# EAGLE design UNOSMD_V11 (EAGLE 9.6.2)
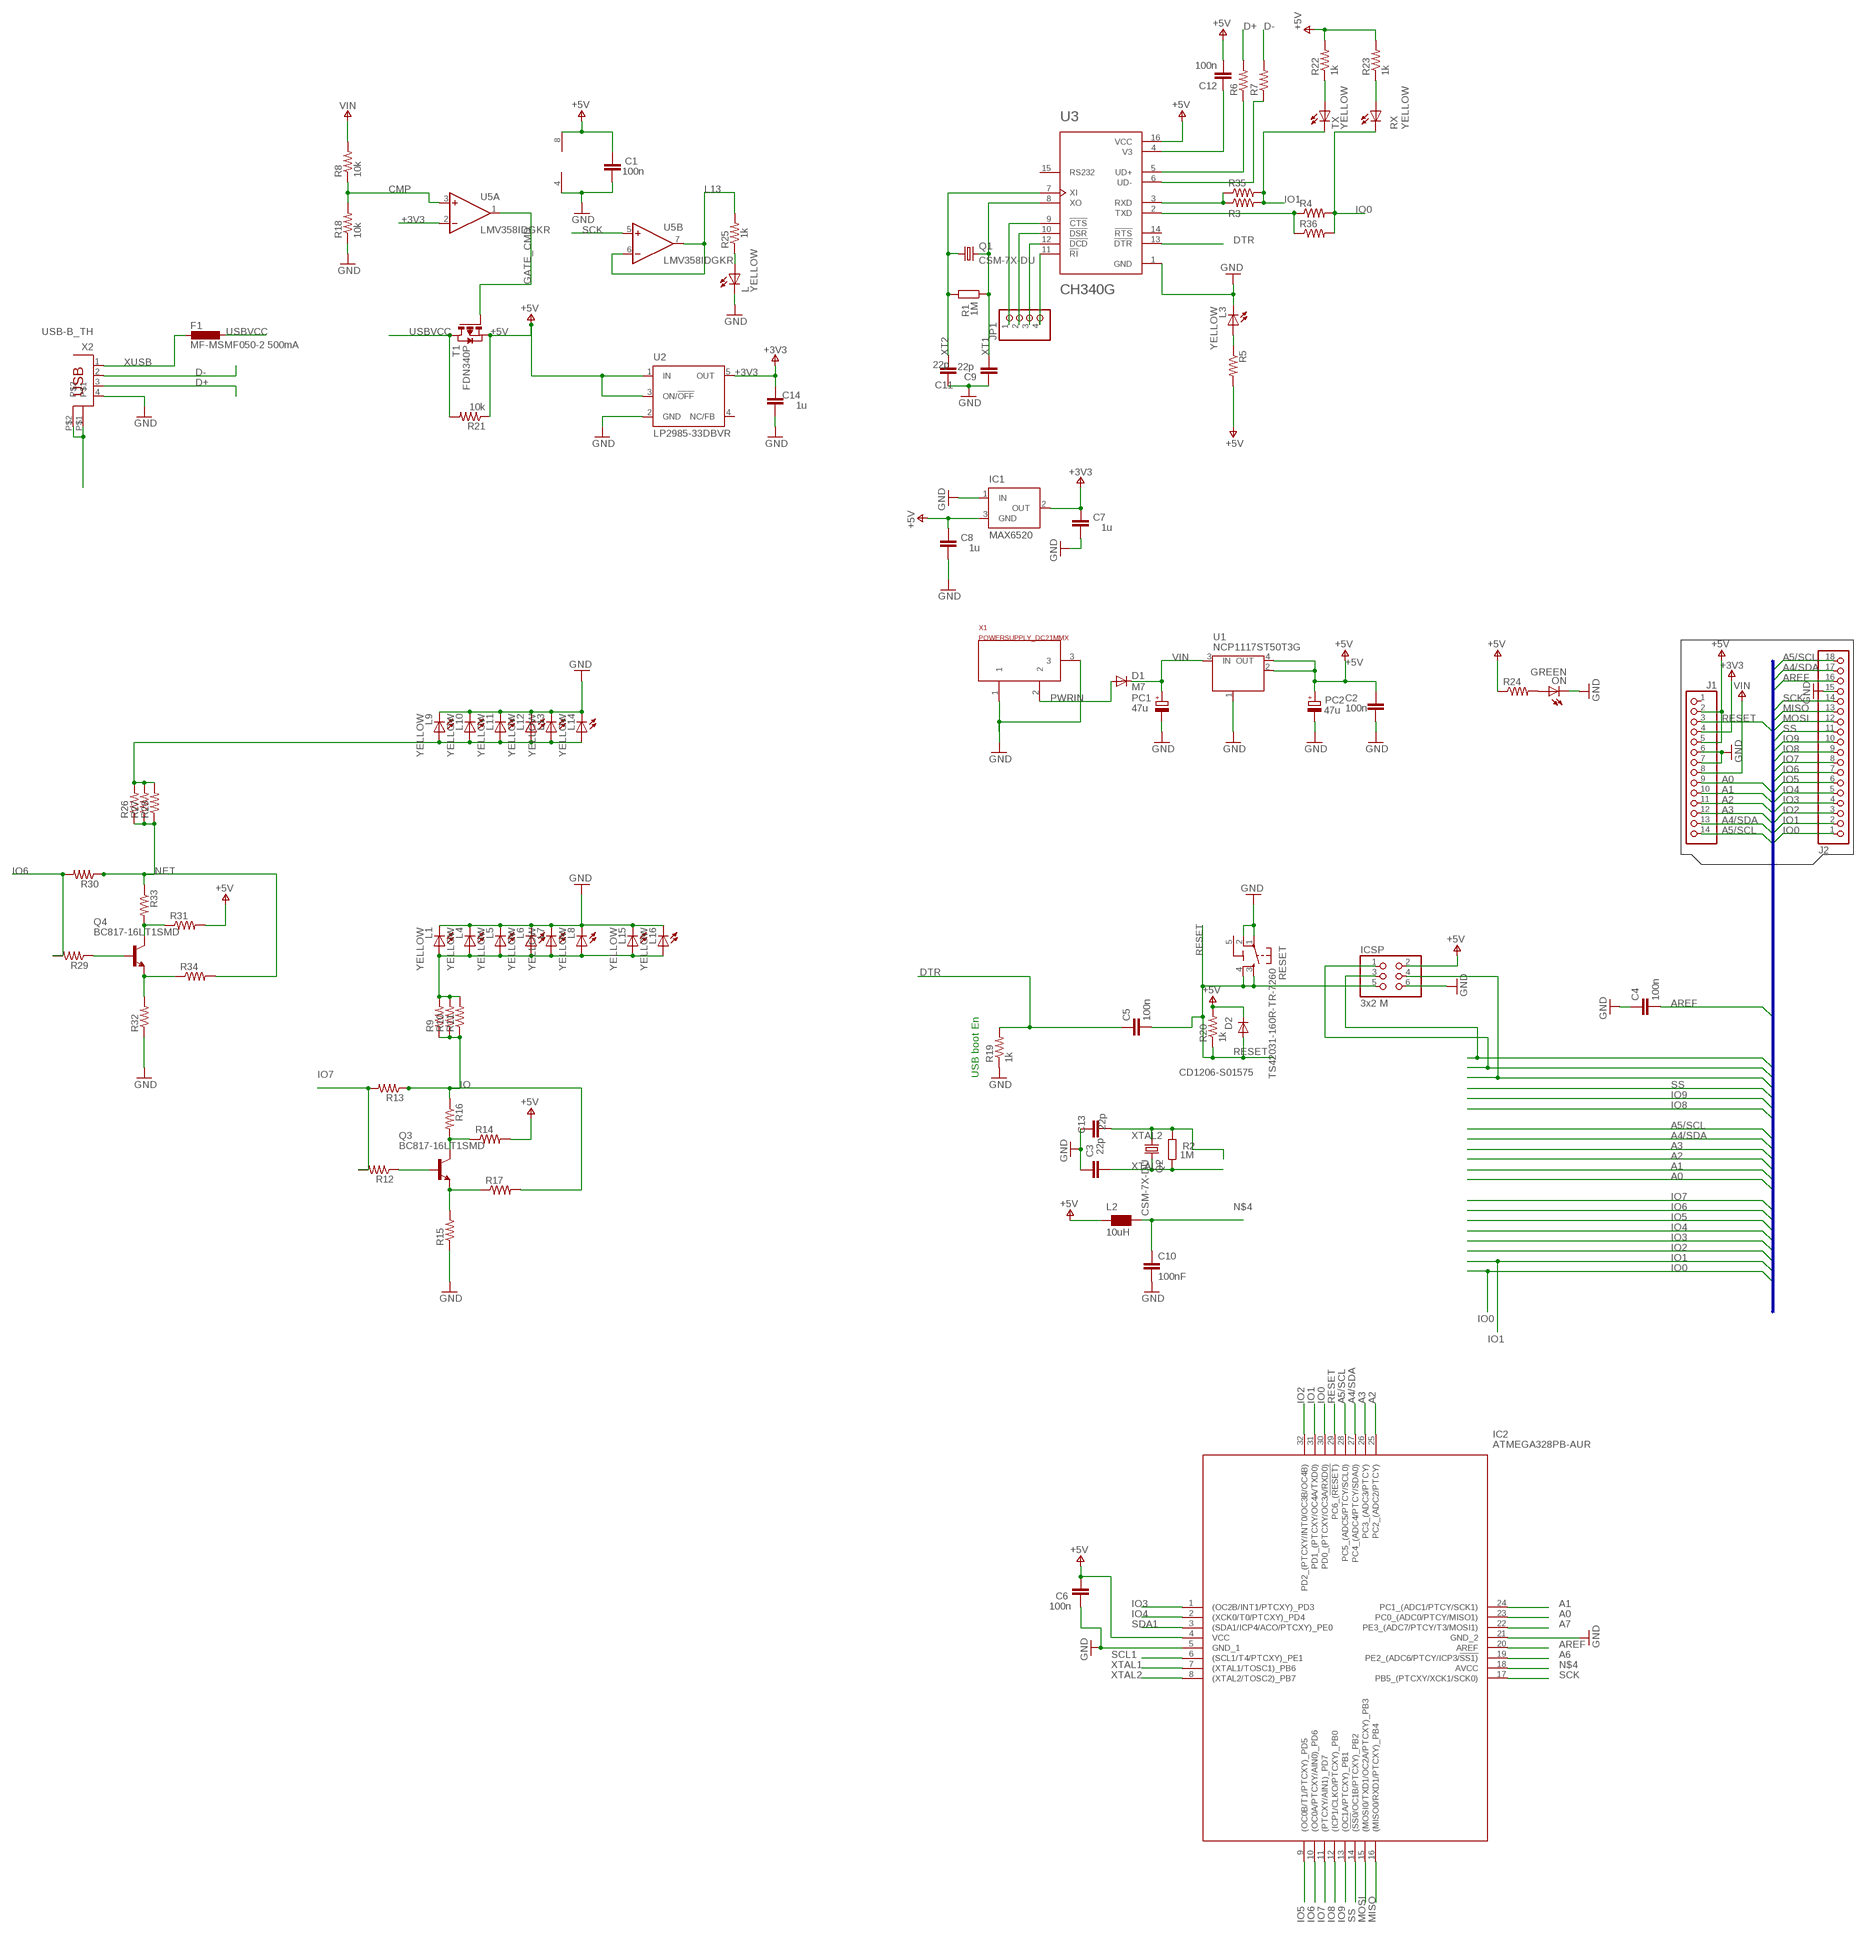
[diagram p0: schematic, sheet 1]

## Parts
C1  100n  C-EU0603-RND  [C0603-ROUND]
C2  100n  C-EU0603-RND  [C0603-ROUND]
C3  22p  C-EU0603-RND  [C0603-ROUND]
C4  100n  C-EU0603-RND  [C0603-ROUND]
C5  100n  C-EU0603-RND  [C0603-ROUND]
C6  100n  C-EU0603-RND  [C0603-ROUND]
C7  1u  C-EU0603-RND  [C0603-ROUND]
C8  1u  C-EU0603-RND  [C0603-ROUND]
C9  22p  C-EU0603-RND  [C0603-ROUND]
C10  100nF  0015_100NF_0603  [C0603-ROUND]
C11  22p  C-EU0603-RND  [C0603-ROUND]
C12  100n  C-EU0603-RND  [C0603-ROUND]
C13  22p  C-EU0603-RND  [C0603-ROUND]
C14  1u  C-EU0603-RND  [C0603-ROUND]
D1  M7  DIODE-SMB  [SMB]
D2  CD1206-S01575  DIODE-MINIMELF  [MINIMELF]
F1  MF-MSMF050-2 500mA  L-EUL1812  [L1812]
IC1  MAX6520  [SOT23]
IC2  ATMEGA328PB-AUR  [QFP80P900X900X120-32N]
ICSP  3x2 M  PINHD-2X3  [2X03]
J1  -  PINHD-1X14-CUSTOM  [1X14-CUSTOM]
J2  -  PINHD-1X18  [1X18-CUSTOM]
JP1  PINHD-1X4  [1X04]
L  YELLOW  LEDCHIP-LED0805  [CHIP-LED0805]
L1  YELLOW  LEDCHIP-LED0805  [CHIP-LED0805]
L2  10uH  0715_CV201210-100K  [0805]
L3  YELLOW  LEDCHIP-LED0805  [CHIP-LED0805]
L4  YELLOW  LEDCHIP-LED0805  [CHIP-LED0805]
L5  YELLOW  LEDCHIP-LED0805  [CHIP-LED0805]
L6  YELLOW  LEDCHIP-LED0805  [CHIP-LED0805]
L7  YELLOW  LEDCHIP-LED0805  [CHIP-LED0805]
L8  YELLOW  LEDCHIP-LED0805  [CHIP-LED0805]
L9  YELLOW  LEDCHIP-LED0805  [CHIP-LED0805]
L10  YELLOW  LEDCHIP-LED0805  [CHIP-LED0805]
L11  YELLOW  LEDCHIP-LED0805  [CHIP-LED0805]
L12  YELLOW  LEDCHIP-LED0805  [CHIP-LED0805]
L13  YELLOW  LEDCHIP-LED0805  [CHIP-LED0805]
L14  YELLOW  LEDCHIP-LED0805  [CHIP-LED0805]
L15  YELLOW  LEDCHIP-LED0805  [CHIP-LED0805]
L16  YELLOW  LEDCHIP-LED0805  [CHIP-LED0805]
ON  GREEN  LEDCHIP-LED0805  [CHIP-LED0805]
PC1  47u  CPOL-EUD  [PANASONIC_D]
PC2  47u  CPOL-EUD  [PANASONIC_D]
Q1  CSM-7X-DU  [CSM-7X-DU]
Q2  CSM-7X-DU  [CSM-7X-DU]
Q3  BC817-16LT1SMD  [SOT23-BEC]
Q4  BC817-16LT1SMD  [SOT23-BEC]
R1  1M  R-EU_R0603  [R0603-ROUND]
R2  1M  R-EU_R0603  [R0603-ROUND]
R3  R-US_R0603  [R0603]
R4  R-US_R0603  [R0603]
R5  R-US_R0603  [R0603]
R6  R-US_R0603  [R0603]
R7  R-US_R0603  [R0603]
R8  10k  R-US_R0603  [R0603]
R9  R-US_R0603  [R0603]
R10  R-US_R0603  [R0603]
R11  R-US_R0603  [R0603]
R12  R-US_R0603  [R0603]
R13  R-US_R0603  [R0603]
R14  R-US_R0603  [R0603]
R15  R-US_R0603  [R0603]
R16  R-US_R0603  [R0603]
R17  R-US_R0603  [R0603]
R18  10k  R-US_R0603  [R0603]
R19  1k  R-US_R0603  [R0603]
R20  1k  R-US_R0603  [R0603]
R21  10k  R-US_R0603  [R0603]
R22  1k  R-US_R0603  [R0603]
R23  1k  R-US_R0603  [R0603]
R24  R-US_R0603  [R0603]
R25  1k  R-US_R0603  [R0603]
R26  R-US_R0603  [R0603]
R27  R-US_R0603  [R0603]
R28  R-US_R0603  [R0603]
R29  R-US_R0603  [R0603]
R30  R-US_R0603  [R0603]
R31  R-US_R0603  [R0603]
R32  R-US_R0603  [R0603]
R33  R-US_R0603  [R0603]
R34  R-US_R0603  [R0603]
R35  R-US_R0603  [R0603]
R36  R-US_R0603  [R0603]
RESET  TS42031-160R-TR-7260  TS42  [TS42]
RX  YELLOW  LEDCHIP-LED0805  [CHIP-LED0805]
T1  FDN340P  PMOSSOT23  [SOT-23]
TX  YELLOW  LEDCHIP-LED0805  [CHIP-LED0805]
U1  NCP1117ST50T3G  MC33269ST-3.3T3  [SOT223]
U2  LP2985-33DBVR  LP2985-XXDBVR33  [SOT23-DBV]
U3  CH340G  [SOIC127P600X180-16N]
U5  LMV358IDGKR  LMV358MMX  [MSOP08]
X1  POWERSUPPLY_DC21MMX  [POWERSUPPLY_DC-21MM]
X2  USB-B_TH  PN61729  [PN61729]

## Nets
+3V3: C7.2 C14.2 IC1.2(OUT) J1.4 U2.5(OUT) U5.2(A:-IN)
+5V [usbvcc]: C1.2 C2.2 C6.2 C8.2 C12.2 D2.C IC1.3(GND) IC2.4(VCC) ICSP.2 J1.2 J1.5 L2.1 PC2.+ R5.2 R14.2 R20.2 R21.1 R22.2 R23.2 R24.1 R31.2 T1.2(S) U1.2(OUT) U1.4(OUT) U2.1(IN) U2.3(ON/!OFF) U3.16(VCC) U5.8(P:V+)
A0: IC2.23(PC0_(ADC0/PTCY/MISO1)) J1.9
A1: IC2.24(PC1_(ADC1/PTCY/SCK1)) J1.10
A2: IC2.25(PC2_(ADC2/PTCY)) J1.11
A3: IC2.26(PC3_(ADC3/PTCY)) J1.12
A4/SDA: IC2.27(PC4_(ADC4/PTCY/SDA0)) J1.13 J2.17
A5/SCL: IC2.28(PC5_(ADC5/PTCY/SCL0)) J1.14 J2.18
A6: IC2.19(PE2_(ADC6/PTCY/ICP3/!SS1))
A7: IC2.22(PE3_(ADC7/PTCY/T3/MOSI1))
AREF [aref]: C4.2 IC2.20(AREF) J2.16
CMP: R8.1 R18.2 U5.3(A:+IN)
D+: R6.2 X2.3
D-: R7.2 X2.2
DTR: C5.1 R19.2 U3.13(!DTR)
GATE_CMD: T1.3(G) U5.1(A:OUT)
GND: C1.1 C2.1 C3.2 C4.1 C6.1 C7.1 C8.1 C9.2 C10.2 C11.2 C13.2 C14.1 IC1.1(IN) IC2.5(GND_1) IC2.21(GND_2) ICSP.6 J1.6 J1.7 J2.15 L1.C L3.C L4.C L5.C L6.C L7.C L8.C L9.C L10.C L11.C L12.C L13.C L14.C L15.C L16.C L.C ON.C PC1.- PC2.- R15.1 R18.1 R19.1 R32.1 RESET.1 RESET.2 U1.1(GND/ADJ) U2.2(GND) U3.1(GND) U5.4(P:V-) X1.1 X1.3 X2.4
IO: R9.1 R10.1 R11.1 R13.1 R16.1 R17.2
IO0: IC2.30(PD0_(PTCXY/OC3A/RXD0)) J2.1 R4.2 R36.2 RX.C
IO1: IC2.31(PD1_(PTCXY/OC4A/TXD0)) J2.2 R3.2 R35.2 TX.C
IO2: IC2.32(PD2_(PTCXY/INT0/OC3B/OC4B)) J2.3
IO3: IC2.1((OC2B/INT1/PTCXY)_PD3) J2.4
IO4: IC2.2((XCK0/T0/PTCXY)_PD4) J2.5
IO5: IC2.9((OC0B/T1/PTCXY)_PD5) J2.6
IO6: IC2.10((OC0A/PTCXY/AIN0)_PD6) J2.7 R29.2 R30.2
IO7: IC2.11((PTCXY/AIN1)_PD7) J2.8 R12.2 R13.2
IO8: IC2.12((ICP1/CLKO/PTCXY)_PB0) J2.9
IO9: IC2.13((OC1A/PTCXY)_PB1) J2.10
L13: R25.2 U5.6(B:-IN) U5.7(B:OUT)
MISO: IC2.16((MISO0/RXD1/PTCXY)_PB4) ICSP.1 J2.13
MOSI: IC2.15((MOSI0/TXD1/OC2A/PTCXY)_PB3) ICSP.4 J2.12
N$1: ON.A R24.2
N$2: R3.1 R35.1 U3.3(RXD)
N$4 [usbvcc]: C10.1 IC2.18(AVCC) L2.2
N$5: R4.1 R36.1 U3.2(TXD)
N$6: C12.1 U3.4(V3)
N$7: L3.A R5.1
N$8: R6.1 U3.5(UD+)
N$9: R7.1 U3.6(UD-)
N$10: L.A R25.1
N$11: Q3.B R12.1
N$12: JP1.1 U3.9(!CTS)
N$13: Q3.E R15.2 R17.1
N$14: Q3.C R14.1 R16.2
N$15: JP1.2 U3.10(!DSR)
N$16: JP1.3 U3.12(!DCD)
N$17: JP1.4 U3.11(!RI)
N$19: L1.A L4.A L5.A L6.A L7.A L8.A L15.A L16.A R9.2 R10.2 R11.2
N$20: Q4.B R29.1
N$21: Q4.E R32.2 R34.1
N$22: Q4.C R31.1 R33.2
N$23: L9.A L10.A L11.A L12.A L13.A L14.A R26.2 R27.2 R28.2
N$35: R23.1 RX.A
N$36: R22.1 TX.A
NET: R26.1 R27.1 R28.1 R30.1 R33.1 R34.2
PWRIN [power]: D1.A X1.2
RESET: C5.2 D2.A IC2.29(PC6_(!RESET)) ICSP.5 J1.3 R20.1 RESET.3 RESET.4
SCK: IC2.17(PB5_(PTCXY/XCK1/SCK0)) ICSP.3 J2.14 U5.5(B:+IN)
SCL1: IC2.6((SCL1/T4/PTCXY)_PE1)
SDA1: IC2.3((SDA1/ICP4/ACO/PTCXY)_PE0)
SS: IC2.14((!SS0!/OC1B/PTCXY)_PB2) J2.11
USBVCC [usbvcc]: F1.1 R21.2 T1.1(D)
USHIELD [gnd]: X2.P$1 X2.P$2
VIN [power]: D1.C J1.8 PC1.+ R8.2 U1.3(IN)
XT1: C9.1 Q1.2 R1.1 U3.8(XO)
XT2: C11.1 Q1.1 R1.2 U3.7(XI)
XTAL1: C3.1 IC2.7((XTAL1/TOSC1)_PB6) Q2.2 R2.1
XTAL2: C13.1 IC2.8((XTAL2/TOSC2)_PB7) Q2.1 R2.2
XUSB [usbvcc]: F1.2 X2.1
Unconnected: J1.1 U2.4(NC/FB) U3.14(!RTS) U3.15(RS232)

## Buses
IO7

## Notes on the sheet
- USB boot En

## Power pins joined to a net without a drawn wire
5-GND: RESET.5(5-GND)

## Library data of the parts
C1-C9 C11-C14 = SmartPrj:C-EU: CAPACITOR, European symbol
C10 = Condensatori:0015_100NF_0603: 100nF 0603; CASE: 0603; MONTHLY_USAGE: _____; PART_NUMBER: 100nF_0603; PRICE: _____; SUPPLIER: _____; TYPE: Condensatori
D1 D2 = diode:DIODE-: DIODE
F1 = rcl:L-EU: INDUCTOR, European symbol
IC1 = maxim:MAX6520: 1.2V Voltage Reference 50ppm/°C, SOT23, 3-Terminal Source: Data sheet <http://datasheets.maxim-ic.com/en/ds/MAX6520.pdf>; MF: MAXIM; MPN: MAX6520EUR-T; OC_FARNELL: unknown; OC_NEWARK: 02J4586
IC2 = ATMEGA328PB-AUR:ATMEGA328PB-AUR: 8-bit Microcontrollers - MCU ATMEGA328PB IND TEMP T&R Source: Datasheet <http://www.atmel.com/Images/Atmel-42397-8-bit-AVR-Microcontroller-ATmega328PB_Summary.pdf>; ARROW_PART_NUMBER: ATMEGA328PB-AUR; ARROW_PRICE-STOCK: https://www.arrow.com/en/products/atmega328pb-aur/microchip-technology?region=nac; DESCRIPTION: 8-bit Microcontrollers - MCU ATMEGA328PB IND TEMP T&R; HEIGHT: 1.2mm; MANUFACTURER_NAME: Microchip; MANUFACTURER_PART_NUMBER: ATMEGA328PB-AUR; MOUSER_PART_NUMBER: 556-ATMEGA328PB-AUR; MOUSER_PRICE-STOCK: https://www.mouser.co.uk/ProductDetail/Microchip-Technology/ATMEGA328PB-AUR?qs=jy4bLUHv09i4S8%252BfUeCffg%3D%3D
ICSP = SmartPrj:PINHD-2X3: PIN HEADER
J1 = Arduino-connectors:PINHD-1X14: PIN HEADER; DATASHEET: -; DISTRIBUTOR-PN: -; MANUFACTURER: -; MANUFACTURER-PN: -
J2 = Arduino-connectors:PINHD-1X18; DATASHEET: -; DISTRIBUTOR-LINK: -; DISTRIBUTOR-PN: -; MANUFACTURER-PN: -; MANUFCATURER: -
JP1 = pinhead:PINHD-1X4: PIN HEADER
L L1 L3-L16 ON RX TX = led:LED: LED OSRAM: - CHIPLED LG R971, LG N971, LY N971, LG Q971, LY Q971, LO R971, LY R971 LH N974, LH R974 LS Q976, LO Q976, LY Q976 LO Q996 - Hyper CHIPLED LW Q18S LB Q993, LB Q99A, LB R99A - SideLED LS A670, LO A670, LY A670, LG A670, LP A670 LB A673, LV A673, LT A673, LW A673 LH A674 LY A675 LS A676, LA A676, LO A676, LY A676, LW A676 LS A679, LY A679, LG A679 - Hyper Micro SIDELED® LS Y876, LA Y876, LO Y876, LY Y876 LT Y87S - SmartLED LW L88C, LW L88S LB L89C, LB L89S, LG L890 LS L89K, LO L89K, LY L89K LS L896, LA L896, LO L896, LY L896 - TOPLED LS T670, LO T670, LY T670, LG T670, LP T670 LSG T670, LSP T670, LSY T670, LOP T670, LYG T670 LG T671, LOG T671, LSG T671 LB T673, LV T673, LT T673, LW T673 LH T674 LS T676, LA T676, LO T676, LY T676, LB T676, LH T676, LSB T676, LW T676 LB T67C, LV T67C, LT T67C, LS T67K, LO T67K, LY T67K, LW E67C LS E67B, LA E67B, LO E67B, LY E67B, LB E67C, LV E67C, LT E67C LW T67C LS T679, LY T679, LG T679 LS T770, LO T770, LY T770, LG T770, LP T770 LB T773, LV T773, LT T773, LW T773 LH T774 LS E675, LA E675, LY E675, LS T675 LS T776, LA T776, LO T776, LY T776, LB T776 LHGB T686 LT T68C, LB T68C - Hyper Mini TOPLED® LB M676 - Mini TOPLED Santana® LG M470 LS M47K, LO M47K, LY M47K Source: http://www.osram.convergy.de LUXEON: - LUMILED® LXK2-PW12-R00, LXK2-PW12-S00, LXK2-PW14-U00, LXK2-PW14-V00 LXK2-PM12-R00, LXK2-PM12-S00, LXK2-PM14-U00 LXK2-PE12-Q00, LXK2-PE12-R00, LXK2-PE12-S00, LXK2-PE14-T00, LXK2-PE14-U00 LXK2-PB12-K00, LXK2-PB12-L00, LXK2-PB12-M00, LXK2-PB14-N00, LXK2-PB14-P00, LXK2-PB14-Q00 LXK2-PR12-L00, LXK2-PR12-M00, LXK2-PR14-Q00, LXK2-PR14-R00 LXK2-PD12-Q00, LXK2-PD12-R00, LXK2-PD12-S00 LXK2-PH12-R00, LXK2-PH12-S00 LXK2-PL12-P00, LXK2-PL12-Q00, LXK2-PL12-R00 Source: www.luxeon.com KINGBRIGHT: KA-3528ASYC Source: www.kingbright.com
L2 = Induttanze:0715_CV201210-100K: 10uH 0805; CASE: 0805; MONTHLY_USAGE: _____; PART_NUMBER: CV201210-100K; PRICE: _____; SUPPLIER: _____; TYPE: Induttanze
PC1 PC2 = rcl:CPOL-EU: POLARIZED CAPACITOR, European symbol
Q1 Q2 = crystal:CSM-7X-DU: SMD CRYSTAL Source: www.ecsxtal.com .. Crystal 3.6864MHz CSM_7X_DU.PDF; OC_FARNELL: unknown; OC_NEWARK: unknown
Q3 Q4 = transistor-npn:BC817*: NPN Transistor
R1 R2 = SmartPrj:R-EU_: RESISTOR, European symbol
R3-R36 = rcl:R-US_: RESISTOR, American symbol; SPICEPREFIX: R
RESET = SmartPrj:TS42: TS42 Dongnan Electronics Tact switch VDC 12V - 50mA
T1 = zetex:PMOSSOT23: MOS FET
U1 = linear:MC33269ST*: Adjustable Output Low Dropout Voltage Regulator 800 mA Source: http://www.onsemi.com/pub/Collateral/MC33269-D.PDF
U2 = SmartPrj:LP2985-XXDBVR: ULTRALOW-POWER 50-mA LOW-DROPOUT LINEAR REGULATORS 50-mA Low-Dropout Regulator Source: http://focus.ti.com/lit/ds/symlink/tps77001.pdf
U3 = CH340G (1):CH340G: Check availability <https://pricing.snapeda.com/parts/Ch340G/WCH/view-part?ref=eda>; AVAILABILITY: Not in stock; CHECK_PRICES: https://www.snapeda.com/parts/Ch340G/WCH/view-part/?ref=eda; DESCRIPTION: USB Interface Integrated Circuit; MF: WCH; MP: Ch340G; PACKAGE: None; PRICE: None; SNAPEDA_LINK: https://www.snapeda.com/parts/Ch340G/WCH/view-part/?ref=snap
U5 = linear:LMV358?*: Dual General Purpose, Low Voltage, Rail-to-Rail Output Operational Amplifiers Source: http://www.national.com/mpf/LM/LMV321.html http://www.national.com/dt/lmv_qual.pdf
X1 = SmartPrj:POWERSUPPLY_DC21MM
X2 = SmartPrj:PN61729: BERG USB connector

## Net classes
0 default: width 0.254 mm, clearance 0.254 mm
1 power: width 0.61 mm, drill 0.61 mm, clearance 0.254 mm
2 gnd: width 0.305 mm, drill 0.559 mm, clearance 0.254 mm
3 usbvcc: width 0.508 mm, drill 0.61 mm, clearance 0.254 mm
4 aref: width 0.406 mm, drill 0.61 mm, clearance 0.254 mm

## Board
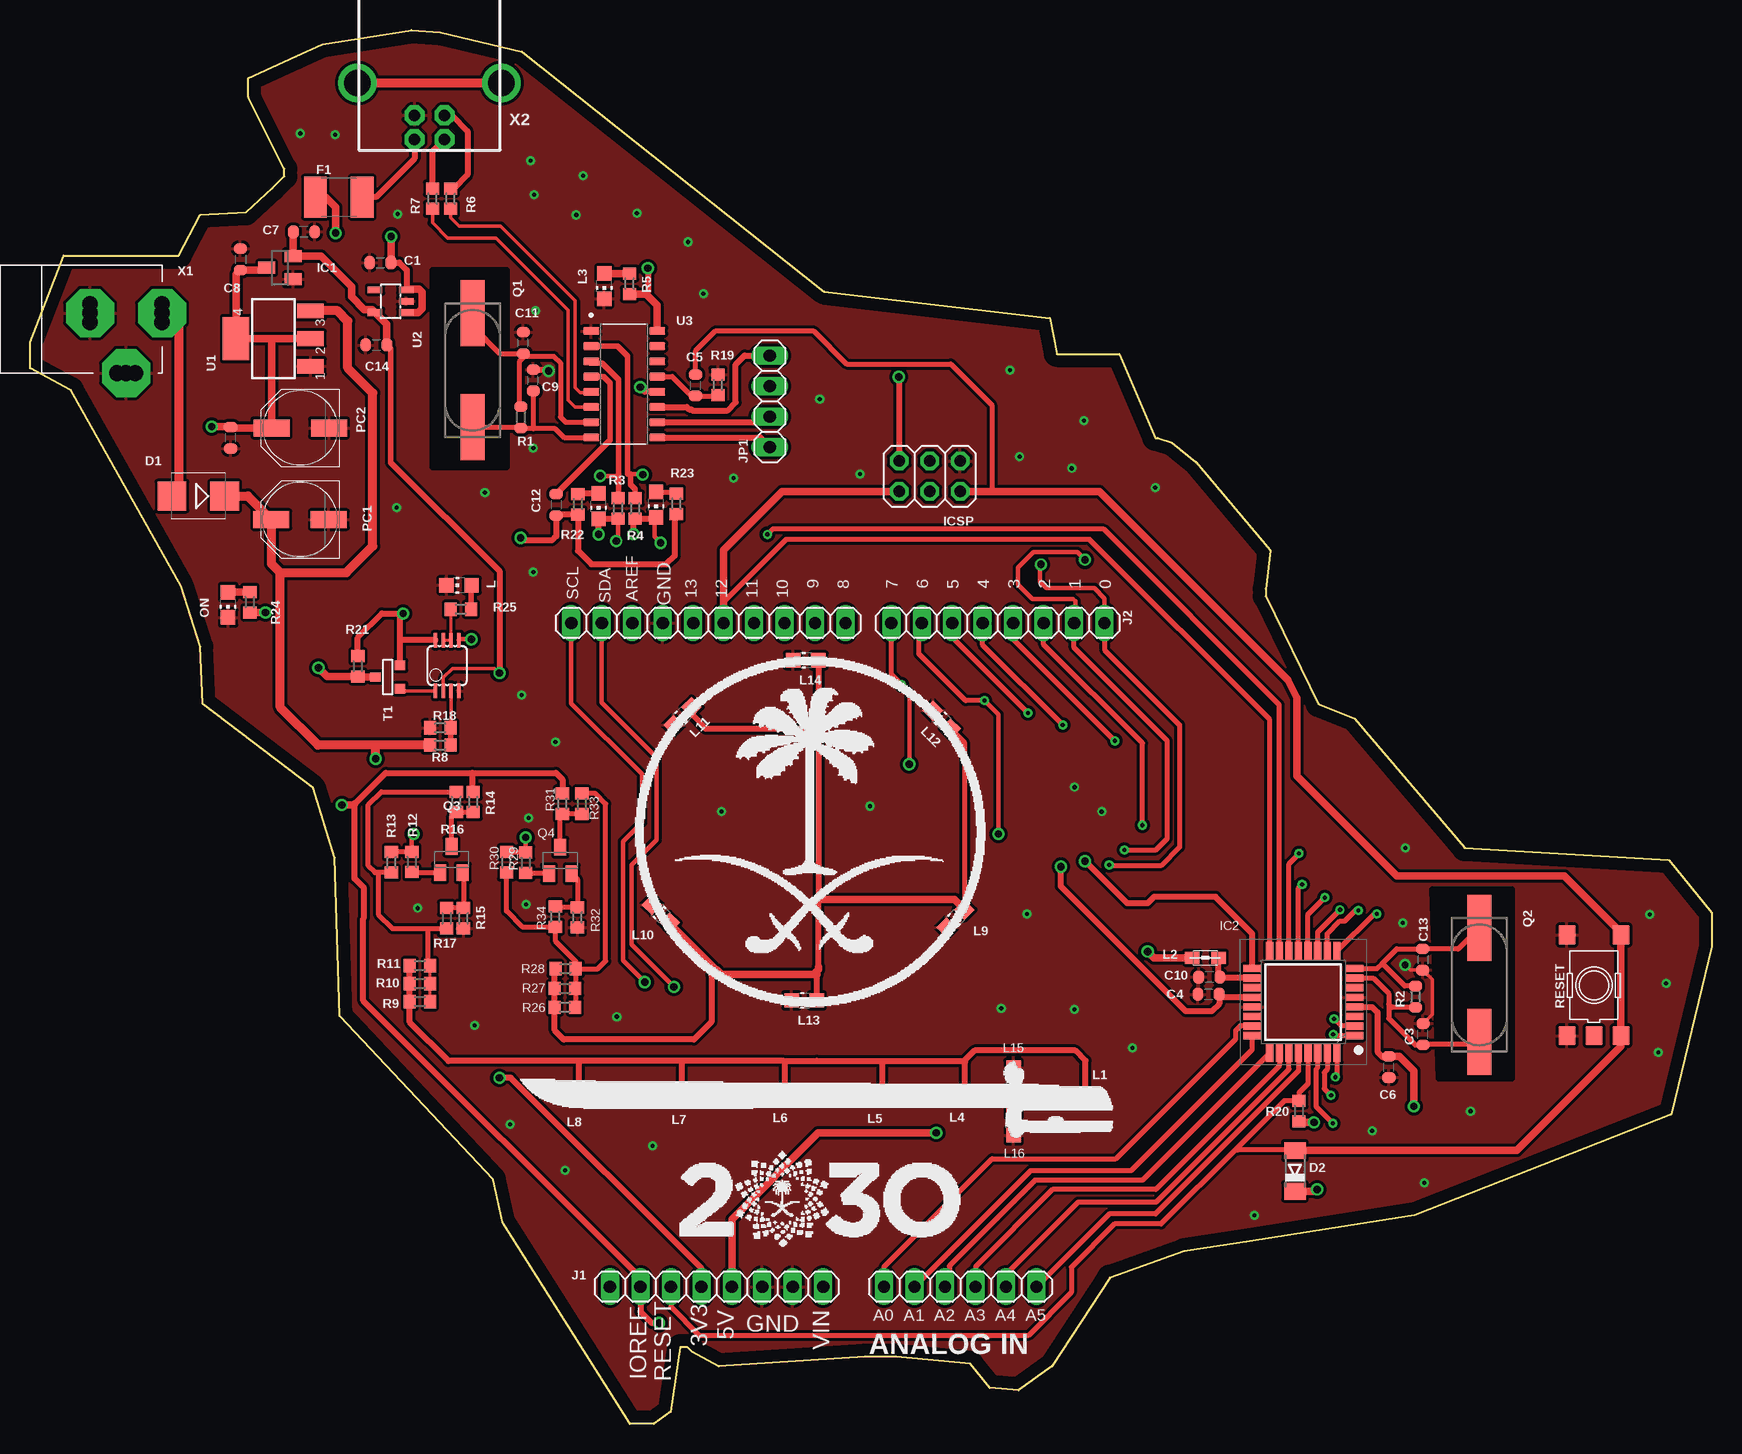
[diagram p1: board, top side]
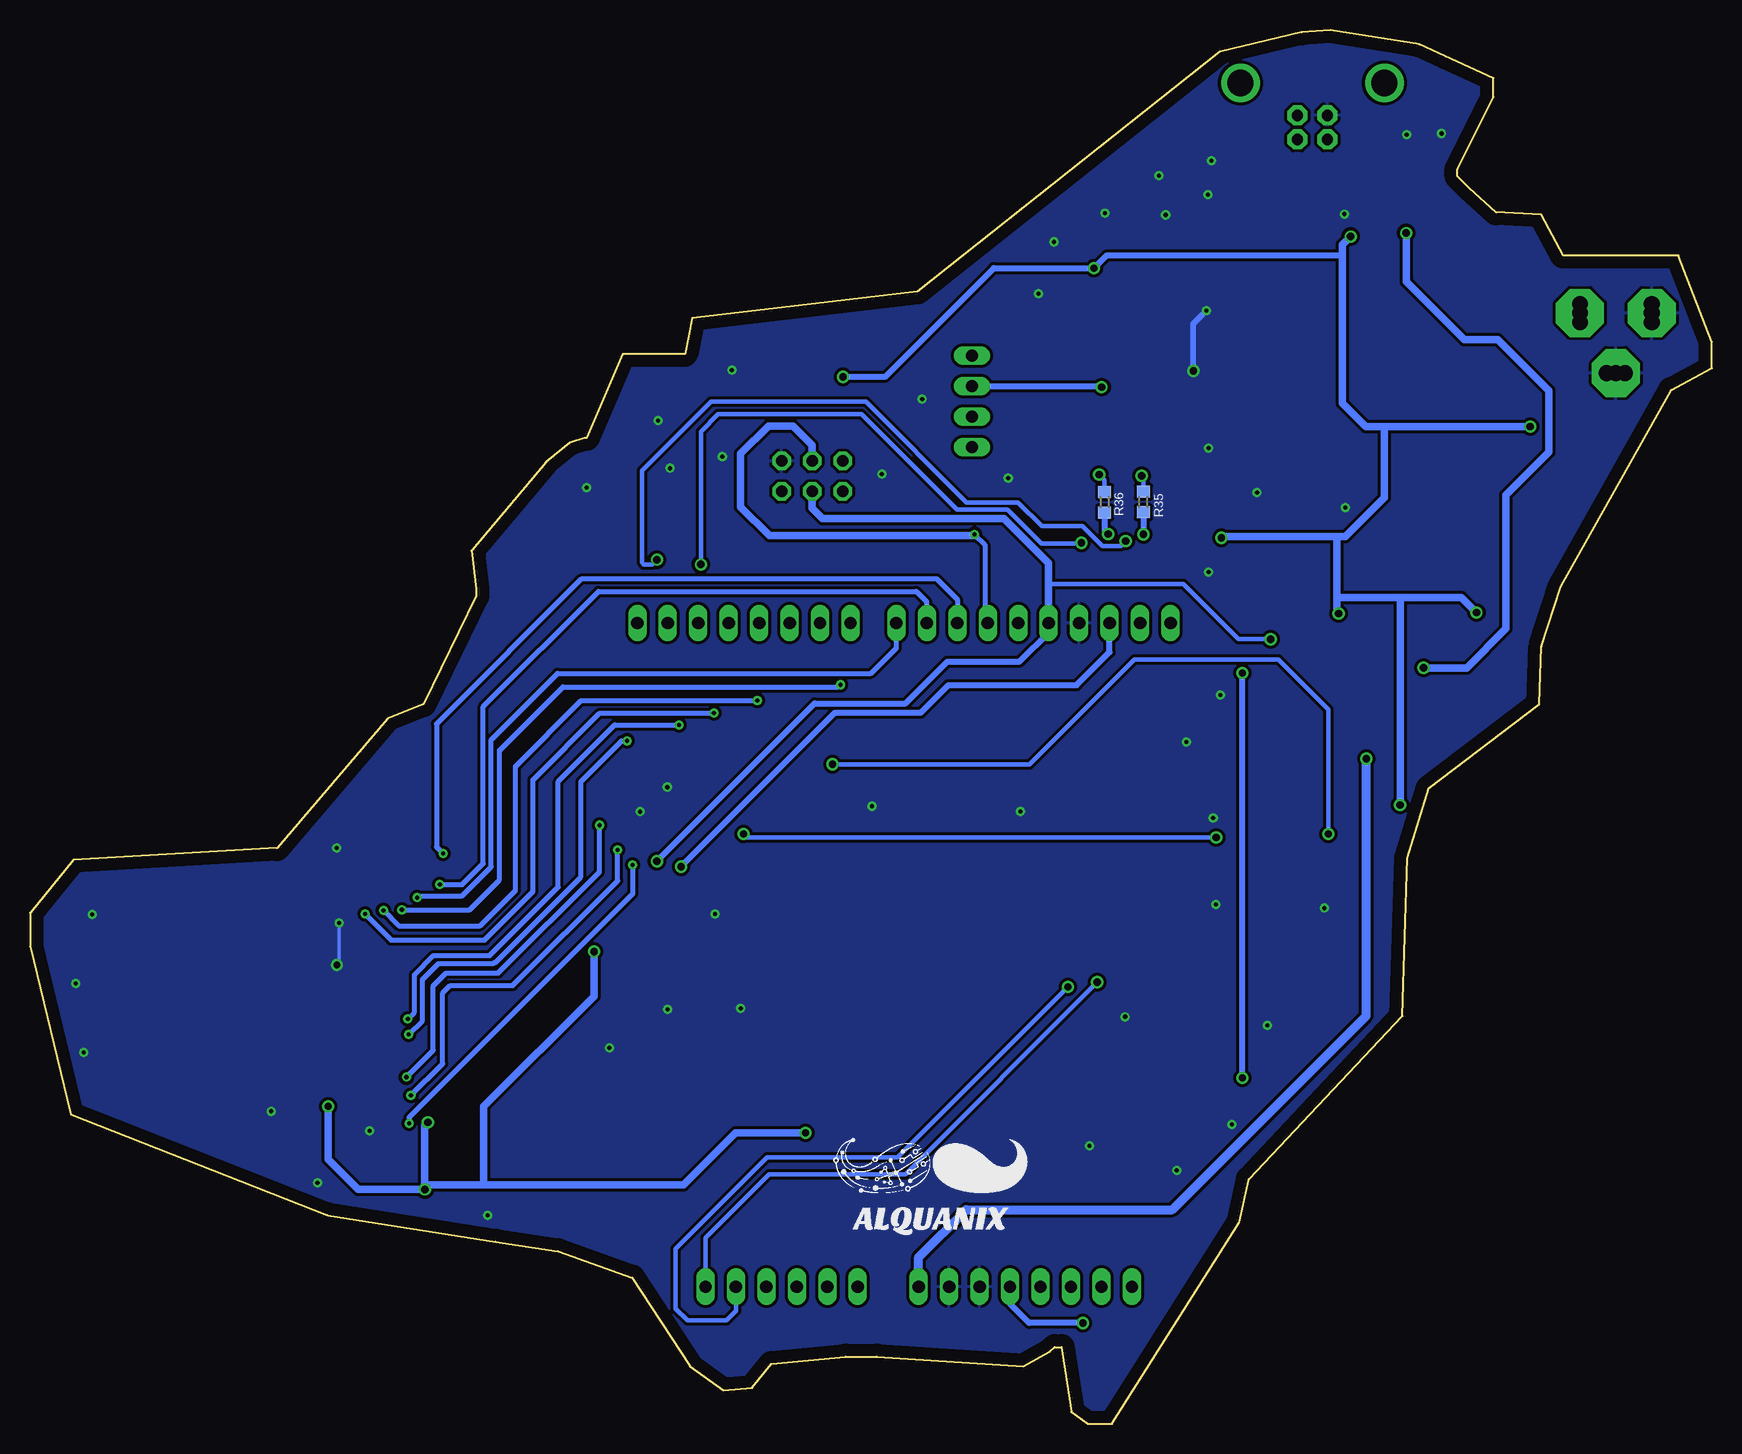
[diagram p2: board, bottom side, seen from below]

Size 140.2 x 116.2 mm. Coordinates in mm from the lower left corner, seen from the top.
Outline: 18.2,112.2 22.2,114 24.4,115 31.8,116.2 34.2,116 41,114.4 66.2,94.4 85,92.2 85.6,89.2 90.8,89.2 93.8,82.2 94,82.2 95.2,81.8 97.2,80.2 103.4,72.8 103,69.6 103,69 107.4,60 110.4,58.8 119.6,48 136.6,47 140.2,42.6 140.2,39.8 136.8,25.8 115.4,17.4 101.4,15.2 96.2,14.4 90,12.2 85.2,4.8 82.4,2.8 80,3 78.4,5 72.2,5.6 69.6,5.6 57.4,4.8 55.2,6 54.8,6.4 54.2,6.4 53.4,1 52,0 50,0 39.4,16.8 38.6,20.4 25.8,34 25.4,47.2 23.6,53 14.4,60 14.2,64.8 12.6,69.8 3.4,86.2 0,88 0,90.2 2.8,97.4 12.4,97.4 14.2,100.8 18,101 20.2,103 21.2,104 21.2,104.6 18.2,110.6 18.2,112.2
Copper layers (1*16): Top 0.035mm / dielectric 1.5mm / Bottom 0.035mm
Design rules "ArduinoUno *": minimum track width 6mil, minimum drill 0.35mm, track to track 6mil, track to pad 6mil, pad to pad 6mil, via to via 10mil, smd to smd 6mil, copper to edge 40mil, drill to drill 6mil, minimum pad ring 10mil, minimum via ring 8mil, stop-mask expansion 4mil, vias tented up to drill 4mil, thermal gap 10mil
bKeepout: area -182.3,-42.6 to -180.3,-34.8
tRestrict: area 33.6,79.8 to 39.7,96.2; area 116.9,28.8 to 123.5,44.5
bRestrict: 5 lines
vRestrict: area -159.3,-1.7 to -157.6,3.3; area -156.8,-0.3 to -155.1,3.3; area -153.8,-0.5 to -152.6,3; area -151.2,-0.5 to -150.1,3; area -148.7,-0.5 to -147.5,3; area -146.1,-0.5 to -145,3; area -143.5,1.4 to -142.3,3; area -141.9,-0.7 to -134.6,1.1; area -121.9,-1.6 to -120.5,0.9; area -119.3,-1.6 to -117.9,0.9; area -120.9,-10 to -117.4,-8.6; area -181.6,-24 to -180.2,-15.7; area -176.5,-23.2 to -174.8,-15.7; area -134.3,-35.5 to -133.7,-35; area -131.8,-35.6 to -131.3,-34.8; area -170.9,-17 to -169.5,-14.7; area -137.4,1.7 to -136.1,3.1; area -134.6,1.6 to -133.4,3.1; area -132,1.6 to -130.9,3.1; area -129.4,1.6 to -128.2,3.1; area -127,1.6 to -125.8,3.1; area -124.3,1.6 to -123.1,3.1; area -121.7,1.6 to -120.6,3.1; area -119.2,1.6 to -118.1,3.1; area -140.9,1.4 to -139.8,3; area -181.9,-33.4 to -172.8,-21.3

### Footprints (pad centres in the part's own frame; a part is rotated, then mirrored left to right if it is on the bottom)
C0603-ROUND = smd 0.898 x 1.1: 1 -0.889,0; 2 0.889,0
SMB = smd 2.4 x 2.4: A 2.2,0; C -2.2,0
MINIMELF = smd 1.4 x 1.8: A 1.7,0; C -1.7,0
L1812 = smd 1.9 x 3.4: 1 -1.95,0; 2 1.95,0
SOT23 = smd 1 x 1.4: 1 -0.95,-1.1; 2 0.95,-1.1; 3 0,1.1
QFP80P900X900X120-32N = smd 1.5 x 0.6: 1 -4.25,2.8; 2 -4.25,2; 3 -4.25,1.2; 4 -4.25,0.4; 5 -4.25,-0.4; 6 -4.25,-1.2; 7 -4.25,-2; 8 -4.25,-2.8; 17 4.25,-2.8; 18 4.25,-2; 19 4.25,-1.2; 20 4.25,-0.4; 21 4.25,0.4; 22 4.25,1.2; 23 4.25,2; 24 4.25,2.8 | smd 0.6 x 1.5: 9 -2.8,-4.25; 10 -2,-4.25; 11 -1.2,-4.25; 12 -0.4,-4.25; 13 0.4,-4.25; 14 1.2,-4.25; 15 2,-4.25; 16 2.8,-4.25; 25 2.8,4.25; 26 2,4.25; 27 1.2,4.25; 28 0.4,4.25; 29 -0.4,4.25; 30 -1.2,4.25; 31 -2,4.25; 32 -2.8,4.25
2X03 = drill 0.95 pad 1.55 octagon: 1 -2.54,-1.27; 2 -2.54,1.27; 3 0,-1.27; 4 0,1.27; 5 2.54,-1.27; 6 2.54,1.27
1X14-CUSTOM = drill 1.016 pad 1.27 long: 1 -17.78,0; 2 -15.24,0; 3 -12.7,0; 4 -10.16,0; 5 -7.62,0; 6 -5.08,0; 7 -2.54,0; 8 0,0; 9 5.08,0; 10 7.62,0; 11 10.16,0; 12 12.7,0; 13 15.24,0; 14 17.78,0
1X18-CUSTOM = drill 1.016 pad 1.27 long: 1 -17.78,0; 2 -15.24,0; 3 -12.7,0; 4 -10.16,0; 5 -7.62,0; 6 -5.08,0; 7 -2.54,0; 8 0,0; 9 3.81,0; 10 6.35,0; 11 8.89,0; 12 11.43,0; 13 13.97,0; 14 16.51,0; 15 19.05,0; 16 21.59,0; 17 24.13,0; 18 26.67,0
1X04 = drill 1.016 long: 1 -3.81,0; 2 -1.27,0; 3 1.27,0; 4 3.81,0
CHIP-LED0805 = smd 1.2 x 1.2: A 0,-1.05; C 0,1.05
0805 = smd 1.2 x 1: 1 -1.1,0; 2 1.1,0
PANASONIC_D = smd 3 x 1.4: + 2.4,0; - -2.4,0
CSM-7X-DU = smd 5.5 x 2: 1 -4.75,0; 2 4.75,0
SOT23-BEC = smd 1 x 1.4: B -0.95,-1.1; C 0,1.1; E 0.95,-1.1
R0603-ROUND = smd 0.898 x 1.1: 1 -0.889,0; 2 0.889,0
R0603 = smd 1 x 1.1: 1 -0.85,0; 2 0.85,0
TS42 = smd 1.6 x 1.4: 1 -4.2,2.25; 2 4.2,2.25; 3 -4.2,-2.25; 4 4.2,-2.25; 5 -4.2,0
SOT-23 = smd 0.787 x 0.889: 1 0.025,-1.016; 2 -0.94,1.016; 3 0.991,1.016
SOT223 = smd 1.219 x 2.235: 1 -2.311,-3.099; 2 0,-3.099; 3 2.311,-3.099 | smd 3.6 x 2.2: 4 0,3.099
SOT23-DBV = smd 0.55 x 1.2: 1 -0.95,-1.3; 2 0,-1.3; 3 0.95,-1.3; 4 0.95,1.3; 5 -0.95,1.3
SOIC127P600X180-16N = smd 1.31 x 0.62: 1 -2.75,4.445; 2 -2.75,3.175; 3 -2.75,1.905; 4 -2.75,0.635; 5 -2.75,-0.635; 6 -2.75,-1.905; 7 -2.75,-3.175; 8 -2.75,-4.445; 9 2.75,-4.445; 10 2.75,-3.175; 11 2.75,-1.905; 12 2.75,-0.635; 13 2.75,0.635; 14 2.75,1.905; 15 2.75,3.175; 16 2.75,4.445
MSOP08 = smd 0.3 x 1.2: 1 -0.976,-2.113; 2 -0.326,-2.113; 3 0.324,-2.113; 4 0.974,-2.113; 5 0.974,2.112; 6 0.324,2.112; 7 -0.326,2.112; 8 -0.976,2.112
POWERSUPPLY_DC-21MM = drill 1.3 pad 4 octagon: 1 -5.08,-3.353; 2 -0.076,-6.35; 3 -0.076,-0.356 | drill 1.3: 4 -5.08,-4.115; 5 -5.08,-2.591; 6 -0.838,-0.356; 7 0.686,-0.356; 8 -0.838,-6.35; 9 0.686,-6.35
PN61729 = drill 0.95 pad 1.676 octagon: 1 1.25,4.71; 2 -1.25,4.71; 3 -1.25,2.71; 4 1.25,2.71 | drill 2.2: P$1 -6,0; P$2 6,0

### Placement (x,y rotation side)
C1  29.2,96.81 0 top
C2  16.73,82.2 90 top
C3  116.11,32.48 90 top
C4  98.24,35.82 0 top
C5  55.48,86.59 90 top
C6  113.27,29.76 90 top
C7  22.85,99.38 180 top
C8  17.53,97.08 270 top
C9  41.95,87 90 top
C10  98.31,37.25 180 top
C11  41.11,90.12 90 top
C12  43.86,76.62 270 top
C13  116.1,38.71 270 top
C14  28.86,89.94 0 top
D1  14.03,77.35 180 top
D2  105.45,21.09 90 top
F1  25.74,102.27 0 top
IC1  20.83,96.38 90 top
IC2  106.14,35.16 180 top
ICSP  75,79.01 0 top
J1  66.12,11.44 0 top
J2  71.79,66.77 180 top
JP1  61.67,85.25 90 top
L  35.77,69.91 90 top
L1  86.94,27.21 90 top
L2  97.98,38.85 0 top
L3  47.87,94.85 180 top
L4  76.9,27.4 90 top
L5  70,27.4 90 top
L6  61.9,27.5 90 top
L7  53.3,27.6 90 top
L8  44.7,27.7 90 top
L9  77.15,42.12 135 top
L10  52.58,42.53 45 top
L11  54.39,59 135 top
L12  76,58.71 45 top
L13  64.54,35.3 90 top
L14  64.66,63.66 90 top
L15  81.99,28.65 0 top
L16  82,25.12 180 top
ON  16.51,68.28 180 top
PC1  22.51,75.39 180 top
PC2  22.54,83.02 180 top
Q1  36.88,87.83 270 top
Q2  120.82,36.6 270 top
Q3  35.13,47.04 0 top
Q4  44.2,46.97 0 top
R1  40.93,83.91 90 top
R2  115.49,35.61 90 top
R3  49.02,76.31 270 top
R4  50.44,76.31 270 top
R5  49.97,95.05 270 top
R6  35.05,102.14 90 top
R7  33.55,102.14 90 top
R8  34.2,56.59 180 top
R9  32.5,35.21 180 top
R10  32.5,36.71 180 top
R11  32.5,38.21 180 top
R12  31.83,46.84 90 top
R13  30.13,46.82 90 top
R14  36.94,51.84 90 top
R15  36.13,42.14 90 top
R16  35.54,51.84 270 top
R17  34.73,42.14 270 top
R18  34.2,58.03 0 top
R19  57.34,86.62 270 top
R20  105.78,26.09 270 top
R21  27.33,63.16 270 top
R22  45.67,76.67 270 top
R23  53.88,76.71 270 top
R24  18.33,68.5 90 top
R25  35.92,67.91 180 top
R26  44.58,34.73 180 top
R27  44.6,36.29 180 top
R28  44.65,37.96 180 top
R29  41.32,46.78 90 top
R30  39.72,46.81 90 top
R31  44.38,51.7 90 top
R32  45.63,42.22 90 top
R33  46.01,51.69 270 top
R34  43.78,42.29 270 top
R35  47.39,76.86 270 bottom
R36  50.63,76.83 270 bottom
RESET  130.36,36.56 90 top
RX  52.19,76.64 180 top
T1  29.82,62.29 270 top
TX  47.4,76.51 180 top
U1  20.28,90.48 90 top
U2  30.06,93.59 90 top
U3  49.53,86.67 0 top
U5  34.77,63.22 0 top
X1  4.66,92.68 90 top
X2  33.3,111.79 180 top

### Tracks (layer width: path | path; a pad name or v marks a point on that pad's centre or on a via)
+3V3  (via drill 0.61)
  Top 0.305: U5.2 34.45,62.23 35.21,62.99 38.74,62.99 v39.14,62.59
  Top 0.457: 39.14,71.08 30.07,80.15 30.07,89.65 29.75,89.98
  Top 0.508: J1.4 55.96,12.95 40.06,28.85 v39.14,28.85 | 39.14,71.08 v39.14,62.59
  Top 0.61: C7.2 21.96,97.35 IC1.2 24.27,97.33 26.8,94.79 26.8,93.96 27.87,92.9 28.51,92.9 U2.5 29.75,91.66 29.75,89.98 C14.2
  Bottom 0.508: v39.14,28.85 v39.14,62.59
+5V  (via drill 0.61)
  Top 0.508: C1.2 30.78,96.8 31.4,96.19 31.4,94.58 U2.3 | 40.94,73.81 v40.89,73.86 41.1,73.64 43.5,73.64 43.86,74 C12.2 43.96,75.83 45.66,75.83 | v51.51,96.35 51.51,94.36 51.35,94.2 | IC2.4 111.86,34.76 112.31,34.31 112.31,31.02 112.77,30.56 113.19,30.56 C6.2 | v52.43,8.42 51.82,8.42 50.88,9.36 J1.2 50.88,12.17 27.78,35.26 27.78,42.14 27.84,42.2 27.84,44.66 27.05,45.46 27.05,51.66 29.65,54.26 36.89,54.26 | R31.2 44.38,53.73 43.85,54.26 36.89,54.26 | R14.2 36.89,52.74 36.89,54.26 | R21.1 27.33,65.54 29.34,67.56 v31.11,67.56 30.84,67.29 30.84,65.3 | T1.2 30.84,65.3 | 33.79,65.35 30.88,65.35 | 30.88,65.35 30.84,65.3 | ICSP.2 72.46,87.24 | R22.2 45.67,72.8 46.81,71.66 53.03,71.66 53.75,72.39 53.75,75.73 | U5.8 30.9,65.34 30.88,65.35
  Top 0.61: U1.2 20.11,90.48 | 20.11,90.48 U1.4 17.18,95.83 C8.2 19.54,96.19 IC1.3 | U2.1 32.35,92.64 32.68,92.97 32.68,94.34 32.45,94.58 31.4,94.58 | 20.11,90.48 20.14,90.45 PC2.+ 16.79,83.02 C2.2 16.67,83.14 v15.15,83.14 | v30.11,98.98 30.11,96.82 C1.2 | R5.2 51.35,94.2 52.28,93.27 U3.16 | v40.89,73.86 40.81,73.94 | 53.75,75.73 R23.2 | 45.66,75.83 R22.2 | v19.63,67.64 18.35,67.64 R24.1 | v25.99,51.6 26.98,51.6 27.05,51.66 | 72.46,87.24 v72.42,87.28 | R20.2 105.87,25.14 v107.03,25.14 | v107.28,19.54 107.13,19.39 D2.C | C6.2 114.15,30.65 115.35,29.45 v115.35,26.48 | L2.1 93.7,38.85 v93.17,39.38 | v75.55,24.27 65.69,24.27 58.5,17.08 J1.5
  Bottom 0.508: 30.79,97.41 50.45,97.41 v51.51,96.35 59.86,96.35 68.93,87.28 v72.42,87.28 | v52.43,8.42 56.92,8.42 58.5,10 J1.5
  Bottom 0.61: v15.15,83.14 27.3,83.14 | 27.3,83.14 28.84,83.14 30.79,85.1 30.79,97.41 30.79,98.29 v30.11,98.98 | 27.3,83.14 27.3,77.23 30.56,73.96 31.1,73.96 | v40.89,73.86 40.79,73.96 31.1,73.96 | 31.27,68.91 31.27,67.73 v31.11,67.56 | 25.98,68.91 20.9,68.91 v19.63,67.64 | 25.98,68.91 31.27,68.91 | 31.27,68.91 31.27,73.78 31.1,73.96 | 25.98,68.91 25.98,51.61 v25.99,51.6 | v107.03,25.14 107.28,24.89 107.28,19.92 | 107.28,19.92 v107.28,19.54 112.83,19.54 115.35,22.06 v115.35,26.48 | v93.17,39.38 93.17,35.66 102.37,26.46 102.37,20.1 102.55,19.92 | 107.28,19.92 102.55,19.92 | 102.55,19.92 85.72,19.92 81.38,24.27 v75.55,24.27
A0
  Top 0.406: J1.9 71.2,13.1 80.21,22.11 90.52,22.11 100.5,32.09 100.5,32.79 100.92,33.21 100.95,33.21 100.95,33.2 101.85,33.2 IC2.23
A1
  Top 0.254: J1.10 73.74,12.69
  Top 0.406: J1.10 83.43,21.13 91.8,21.13 101.89,31.22 IC2.24
A2
  Top 0.406: IC2.25 92.75,20.32 83.76,20.32 76.63,13.18 76.63,11.06 76.28,11.4 J1.11
A3
  Top 0.406: IC2.26 104.14,29.84 93.85,19.54 85.25,19.54 78.82,13.11 J1.12
  Bottom 0.305: 78.51,11.75 J1.12
A4/SDA  (via drill 0.61)
  Top 0.356: J2.17 47.66,60.14 52.24,55.56 52.24,48.66 50.16,46.58 50.16,39.95 v53.68,36.43
  Top 0.406: J1.13 81.36,12.46 87.4,18.5 93.88,18.5 104.94,29.56 IC2.27
  Bottom 0.356: v53.68,36.43 67.9,22.21 78.76,22.21 86.38,14.59 86.38,9.61 85.4,8.63 82.14,8.63 81.36,9.41 J1.13
A5/SCL  (via drill 0.61)
  Top 0.356: J2.18 45.12,60.07 51.01,54.19 51.01,50.12 49.44,48.55 49.44,38.63 v51.24,36.83
  Top 0.406: IC2.28 105.74,29.43 93.82,17.51 89.97,17.51 J1.14
  Bottom 0.356: v51.24,36.83 67.24,20.82 78.61,20.82 83.9,15.53 J1.14
AREF  (via drill 0.61)
  Top 0.508: IC2.20 99.38,35.56 C4.2 99.13,35.03 98.5,34.4 96.35,34.4 85.94,44.81 v85.94,46.45
  Bottom 0.508: v85.94,46.45 73.09,59.29 65.93,59.29 63.65,61.58 52.95,61.58 50.2,64.33 J2.16
CMP
  Top 0.305: U5.3 35.1,58.08 R18.2
  Top 0.457: 35.03,56.58 R8.1 R18.2
D+
  Top 0.508: X2.3 35.17,109.08 36.47,107.78 36.47,104.12 35.34,102.99 R6.2
D-
  Top 0.508: R7.2 33.55,106.08 X2.2
  Bottom 0.305: X2.2
DTR
  Top 0.254: 54.98,85.7 C5.1
  Top 0.406: U3.13 53.53,87.31 55.14,85.7 C5.1 57.27,85.7 R19.2
  Top 0.508: 52.29,87.29 U3.13
GATE_CMD
  Top 0.254: 30.92,61.21 T1.3
  Top 0.305: U5.1 31.02,61.11 30.92,61.21
GND  (via drill 0.35, 0.56, 0.61)
  Top 0.305: C3.2 116.89,34.15 116.89,37.05 116.55,37.39 116.54,37.39 C13.2 115.06,37.83 v114.62,38.26
  Top 0.508: C9.2 43.11,87.89 v43.23,87.78
  Bottom 0.305: v114.62,38.26 114.43,38.45 v114.43,41.77
  Bottom 0.508: v43.23,87.78 43.23,91.72 v42.15,92.8
  other vias: 56.13,94.23 65.83,85.43 87.08,53.08 83.1,42.52 89.34,51.04 41.96,81.34 37.92,77.63 30.56,76.39 40.98,60.77 57.64,51.05 70.02,51.49 80.96,34.63 87.07,34.55 91.9,31.34 120.09,26.07 111.88,24.43 114.65,48.01 135.02,42.48 136.38,36.72 135.73,30.96 116.24,20.1 102.06,17.38 51.89,23.17 44.61,21.13 37.05,33.22 32.3,43 41.35,43.32 41.57,50.52 43.8,56.85 45.54,100.78 42.02,102.47 25.45,107.46 22.54,107.58 30.64,100.86 41.73,105.3 46.11,104.06 50.59,100.94 54.86,98.54 81.69,87.84 87.85,83.63 93.8,78.06 82.49,80.64 86.84,79.66 69.2,79.17 58.66,78.85 41.96,71.01 48.91,33.94 40.02,24.98
  pour Top (isolate 0.203): -10.76,117.76 148.56,117.76 148.56,56.94 148.56,0.12 123.45,0.12 -10.76,0.12
  pour Bottom (isolate 0.203): -10.76,117.78 147.42,117.78 147.42,-0.23 -10.88,-0.23 -10.88,7.62 -10.88,117.78 -10.78,117.78
IO
  Top 0.254: R9.1 R10.1 33.35,38.02 R11.1
  Top 0.406: R13.1 29.03,45.97 | 29.03,45.97 28.76,45.97 28.2,46.53 28.2,51.62 29.27,52.69 R16.1 | 29.03,45.97 29.03,42.48 30.21,41.29 33.13,41.29 | 33.13,41.29 R17.2 | 33.13,41.29 33.13,38.24 33.35,38.02
IO0  (via drill 0.35, 0.61)
  Top 0.356: J2.1 89.57,68.81 88.72,69.67 84.72,69.67 84.19,70.19 84.19,71.57 v84.27,71.65 | v52.56,73.45 52.06,73.95 52.06,75.46
  Top 0.406: J2.1 89.57,64.52 95.83,58.26 95.83,48.08 94.27,46.52 90.05,46.52 v89.96,46.61 | IC2.30 107.34,29.69 107.22,29.58 107.22,26.45 v108.61,25.07
  Top 0.508: RX.C 52.06,75.46 R4.2 50.32,75.34 v50.32,74.18
  Bottom 0.356: v52.56,73.45 52.64,73.38 55.87,73.38 58.71,76.21 62.94,76.21 70.89,84.16 82.84,84.16 84.27,82.72 v84.27,71.65
  Bottom 0.406: v89.96,46.61 89.96,44.18 108.61,25.54 v108.61,25.07
  Bottom 0.508: R36.2 50.63,74.49 v50.32,74.18
IO1  (via drill 0.35, 0.61)
  Top 0.356: R3.2 49.02,73.75 v48.86,73.59 | v87.94,72.04 87.29,72.69 83.65,72.69 82.35,71.4 82.35,69.97 83.57,68.75 86.95,68.75 87.13,68.58 87.13,66.64 87.03,66.54
  Top 0.406: IC2.31 108.14,29.56 107.88,29.3 107.88,27.95 v108.45,27.38 | v91.22,47.85 93.87,47.85 94.81,48.79 94.81,56.93 87.03,64.71 87.03,66.54 J2.2
  Top 0.508: TX.C 47.43,75.46 | 47.43,75.46 R3.2 | v47.39,74.15 47.39,75.43 47.43,75.46
  Bottom 0.356: v48.86,73.59 49.27,73.19 50.81,73.19 52.46,74.84 55.86,74.84 57.84,76.82 62.12,76.82 70.52,85.21 83.45,85.21 89.2,79.46 89.2,71.8 89.03,71.64 88.35,71.64 v87.94,72.04
  Bottom 0.406: v108.45,27.38 105.8,30.03 105.8,35.91 105.18,36.53 99.96,36.53 91.22,45.27 v91.22,47.85
  Bottom 0.508: R35.2 v47.39,74.15
IO2  (via drill 0.35)
  Top 0.406: IC2.32 108.94,29.03 v108.82,28.91 | v92.73,49.91 92.73,56.75 84.49,64.99 J2.3
  Bottom 0.406: v108.82,28.91 106.59,31.15 106.59,36.52 105.53,37.58 101.16,37.58 92.73,46.01 v92.73,49.91
IO3  (via drill 0.35)
  Top 0.406: IC2.1 108.74,32.36 v108.63,32.47 | v90.43,56.94 81.95,65.42 J2.4
  Bottom 0.406: v108.63,32.47 107.49,33.61 107.49,37.04 106.15,38.38 101.61,38.38 101.55,38.44 101.44,38.44 94.28,45.6 94.28,53.55 90.89,56.94 v90.43,56.94
IO4  (via drill 0.35)
  Top 0.406: IC2.2 109.3,33.16 v108.71,33.75 | v86.09,58.26 79.41,64.94 J2.5
  Bottom 0.406: v108.71,33.75 108.15,34.31 108.15,37.45 106.56,39.04 101.89,39.04 96.17,44.75 96.17,53.55 91.46,58.26 v86.09,58.26
IO5  (via drill 0.35)
  Top 0.406: IC2.9 112.04,42.52 v112.28,42.52 | v83.19,59.25 76.98,65.47 76.98,67.46 76.87,67.35 J2.6
  Bottom 0.406: v112.28,42.52 110.1,40.34 102.29,40.34 98.27,44.37 98.27,53.69 92.7,59.25 v83.19,59.25
IO6  (via drill 0.35, 0.61)
  Top 0.356: R29.2 v41.32,48.89 | v80.73,49.18 80.73,59.14 v79.57,60.3
  Top 0.406: IC2.10 108.14,40.86 109.2,41.92 109.59,41.92 110.48,42.81 v110.74,42.81 | v79.57,60.3 78,60.3 74.1,64.2 74.1,66.53 J2.7 | R30.2 41.3,47.66 R29.2
  Bottom 0.356: v41.32,48.89 80.44,48.89 v80.73,49.18
  Bottom 0.406: v110.74,42.81 109.46,41.53 102.67,41.53 99.74,44.46 99.74,54.82 94.27,60.3 v79.57,60.3
IO7  (via drill 0.35, 0.61)
  Top 0.356: R12.2 31.83,49.04 v31.97,49.18 | v73.3,54.99 73.3,60.96 v72.64,61.62
  Top 0.406: IC2.11 107.34,41 v109.2,42.86 | v72.64,61.62 71.79,62.46 J2.8 | R12.2 30.16,47.69 R13.2
  Bottom 0.356: v31.97,49.18 31.97,59.56 36.14,63.73 48.14,63.73 56.88,54.99 v73.3,54.99
  Bottom 0.406: v109.2,42.86 103.55,42.86 101.06,45.35 101.06,56.16 95.78,61.44 72.82,61.44 v72.64,61.62
IO8  (via drill 0.35)
  Top 0.406: IC2.12 106.54,42.48 v107.93,43.88
  Bottom 0.406: v107.93,43.88 107.78,44.03 104.18,44.03 101.76,46.45 101.76,57.02 96.22,62.56 70.1,62.56 67.98,64.67 J2.9
IO9  (via drill 0.35)
  Top 0.406: IC2.13 105.74,44.67 v106.04,44.97
  Bottom 0.406: v106.04,44.97 104.17,44.97 102.42,46.72 102.42,59.8 92.82,69.4 66.31,69.4 65.46,68.55 65.46,66.78 J2.10
L13
  Top 0.254: R25.2 35.1,67.89 U5.6 U5.7
MISO
  Top 0.406: IC2.16 103.34,58.71 88.32,73.73 63.04,73.73 57.82,68.52 J2.13
  Top 0.61: J2.13 57.82,72.86 62.7,77.73 ICSP.1
MOSI  (via drill 0.35)
  Top 0.406: v61.46,74.15 61.89,74.58 89.5,74.58 104.14,59.95 IC2.15
  Bottom 0.406: v61.46,74.15 60.61,73.3 60.61,67.01 J2.12
  Bottom 0.61: ICSP.4 75,81.58 76.59,83.17 78.66,83.17 80.96,80.87 80.96,76.42 78.57,74.04 61.58,74.04 v61.46,74.15
N$1
  Top 0.61: ON.A 18.31,69.33 R24.2
N$2  (via drill 0.61)
  Top 0.356: v47.53,79.03 47.54,79.02 49.06,79.02
  Top 0.457: R3.1 49.02,77.07 49.06,77.03 49.06,79.02 49.06,87.07 47.68,88.45 46.7,88.45 46.78,88.53 U3.3
  Bottom 0.356: R35.1 47.39,78.89 v47.53,79.03
N$4
  Top 0.508: IC2.18 99.29,37.16 C10.1 99.08,37.37 L2.2
N$5  (via drill 0.61)
  Top 0.356: v51.07,79.13 51.02,79.18 50.06,79.18 49.81,79.18
  Top 0.457: U3.2 48.98,89.85 49.81,89.02 49.81,79.18 | 50.06,79.18 50.06,78.3 50.45,77.91 R4.1
  Bottom 0.356: R36.1 50.63,78.69 v51.07,79.13
N$6
  Top 0.457: C12.1 48.35,82 48.35,86.76 47.8,87.31 U3.4
N$7
  Top 0.61: L3.A R5.1
N$8
  Top 0.305: R6.1 35.05,100.54 35.76,99.83 39.24,99.83 45.44,93.63 45.44,86.41 45.87,85.98 46.72,85.98 U3.5
N$9
  Top 0.305: R7.1 33.55,100.13 34.83,98.85 38.86,98.85 44.86,92.85 44.86,85.35 45.45,84.77 U3.6
N$10
  Top 0.457: R25.1 36.77,69.87 L.A
N$11
  Top 0.406: Q3.B 31.88,45.94 R12.1
N$12
  Top 0.508: U3.9 60.89,82.23 JP1.1
N$13
  Top 0.406: Q3.E 36.13,45.89 R15.2 R17.1
N$14
  Top 0.406: Q3.C 35.13,50.58 R16.2 R14.1
N$15
  Top 0.508: U3.10 61.19,83.5 JP1.2
N$16  (via drill 0.61)
  Top 0.508: v50.88,86.43 51.26,86.05 52.26,86.05 U3.12
  Bottom 0.508: 61.37,86.22 JP1.3 50.96,86.52 v50.88,86.43
N$17
  Top 0.508: U3.11 54.74,84.77 54.94,84.56 55.13,84.56 55.2,84.49 58.16,84.49 58.83,85.16 58.83,88.33 59.57,89.06 JP1.4
N$19
  Top 0.508: L15.A 82,27.59 82,27.03 | 82,27.03 L16.A | 62.87,30.25 54.36,30.25 | 62.87,30.25 65.63,30.25 | 65.63,30.25 70.92,30.25 | 70.92,30.25 77.86,30.25 | 77.86,30.25 78.75,31.14 87.13,31.14 87.99,30.27 L1.A | L5.A 71.05,30.12 70.92,30.25 | L6.A 62.95,30.17 62.87,30.25 | L7.A 54.35,30.23 54.36,30.25 | 65.59,30.29 65.63,30.25 | R11.2 R10.2 R9.2 31.65,33.48 34.88,30.25 45.92,30.25 | 54.36,30.25 45.92,30.25 | L8.A 45.75,30.08 45.92,30.25 | 77.86,30.25 77.95,30.16 L4.A 81.63,27.4 82,27.03
N$20
  Top 0.406: R29.1 43.19,45.93 Q4.B
N$21
  Top 0.406: Q4.E 45.62,45.4 R32.2 43.85,43.07 R34.1
N$22
  Top 0.406: Q4.C 44.2,50.67 R31.1 44.39,50.84 R33.2
N$23
  Top 0.406: L12.A 77.89,56.82 L9.A
  Top 0.508: L10.A 57.26,37.86 56.8,37.4 56.8,33.5 55.35,32.05 44.5,32.05 43.73,32.81 R26.2 43.73,36.28 R27.2 43.75,37.91 R28.2 | L13.A 65.59,37.47 | 65.72,57.97 56.33,57.97 55.13,59.16 L11.A | L14.A 65.71,57.97 65.72,57.97 | 65.72,57.97 65.72,43.71 65.72,38.11
  Top 0.61: L9.A 77.04,43.71 65.72,43.71 | 57.26,37.86 57.64,37.47 65.3,37.47 | 65.3,37.47 65.59,37.47 | 65.3,37.47 65.72,37.89 65.72,38.11
N$35
  Top 0.406: RX.A 53.75,77.69 R23.1
N$36
  Top 0.508: TX.A 45.71,77.56 R22.1
NET
  Top 0.406: R30.1 39.72,42.76 41.04,41.44 R34.2 43.78,40.28 45.5,38.57 R28.1 | R28.1 45.5,36.34 R27.1 45.5,36.24 45.5,34.8 R26.1 | R28.1 45.52,37.93 47.33,37.93 47.99,38.59 47.99,51.7 47.15,52.53 R33.1
PWRIN
  Top 0.61: 12.42,91.85 11.67,92.6 X1.2 | 12.42,77.94 D1.A
  Top 0.762: 12.42,91.85 12.42,77.94
RESET
  Top 0.406: IC2.29 106.54,28.36 105.78,27.6 R20.1 104.56,26.94 100.56,22.94 | 100.56,22.94 94.28,16.66 90.41,16.66 86.81,13.06 86.81,10.96 83.25,7.4 55.79,7.4 53.42,9.77 J1.3 | 105.4,22.84 100.66,22.84 100.56,22.94 | C5.2 55.48,89.45 57.16,91.13 65.31,91.13 68.08,88.36 76.77,88.36 80.18,84.95 80.18,77.8 80.25,77.73
  Top 0.61: ICSP.5 80.25,77.73 89.13,77.73 104.87,62 105.6,60.51 105.6,54.02 113.93,45.68 127.89,45.68 132.61,40.96 RESET.4 RESET.3 132.61,31.48 123.93,22.81 105.47,22.81 D2.A 105.4,22.84
SCK  (via drill 0.61)
  Top 0.356: U5.5 35.83,65.41 v36.79,65.41
  Top 0.508: IC2.17 101.89,40.86 98.81,43.94 93.71,43.94 93.16,43.39 91.46,43.39 v87.94,46.91
  Bottom 0.356: v36.79,65.41 39.47,65.41 44.06,70.01 55.28,70.01
  Bottom 0.508: v87.94,46.91 74.8,60.06 67.22,60.06 63.74,63.53 57.73,63.53 55.19,66.07 55.19,66.67 J2.14
  Bottom 0.61: ICSP.3 75,76.35 74.12,75.47 59.01,75.47 55.28,71.75 55.28,70.01 J2.14
SS  (via drill 0.35)
  Top 0.406: IC2.14 104.94,46.69 105.93,47.68 105.93,47.71 105.91,47.71 v105.76,47.56
  Bottom 0.406: v105.76,47.56 106.32,48.12 106.32,58.37 94.22,70.47 64.64,70.47 62.9,68.73 J2.11
USBVCC  (via drill 0.61)
  Top 0.61: T1.1 27.22,62.26 R21.2 24.75,62.31 v24.04,63.03 | v25.48,99.27 25.48,101.43 24.65,102.27 F1.1
  Bottom 0.61: v24.04,63.03 20.44,63.03 17.18,66.29 17.18,77.42 13.6,81 13.6,86.15 17.83,90.38 20.66,90.38 25.48,95.21 v25.48,99.27
USHIELD
  Top 0.762: X2.P$2 X2.P$1
VIN  (via drill 0.61)
  Top 0.762: D1.C 18.15,77.35 PC1.+ 20.11,71.71 20.87,70.95 | 20.87,70.95 26.36,70.95 28.57,73.16 28.57,85.95 26.5,88.02 26.5,91.94 25.66,92.79 U1.3 | 20.87,70.95 20.87,59.74 24.02,56.59 28.93,56.59 | R8.2 28.93,56.59 | v28.81,55.44 28.81,56.48 28.93,56.59
  Bottom 0.762: J1.8 66.12,13.89 62.15,17.87 44.98,17.87 28.81,34.03 v28.81,55.44
XT1
  Top 0.406: Q1.2 40.87,83.08 R1.1 40.98,82.97 41.95,82.97 | 41.95,82.97 43.78,82.97 44.52,82.23 U3.8 | C9.1 41.95,82.97
XT2
  Top 0.406: C11.1 41.11,88.87 40.79,88.55 40.79,84.94 R1.2 | Q1.1 36.88,91.5 39.16,89.23 C11.1 | C11.1 41.35,88.99 43.68,88.99 44.22,88.45 44.22,83.94 44.66,83.5 U3.7
XTAL1
  Top 0.406: IC2.7 111.98,37.16 113.25,35.89 113.25,34.98 | 113.25,34.98 113.25,33.8 115.46,31.59 C3.1 116.17,31.64 120.61,31.64 Q2.2 | R2.1 113.52,34.72 113.25,34.98
XTAL2
  Top 0.406: IC2.8 112.28,37.96 112.72,38.4 | Q2.1 119.06,39.59 C13.1 113.92,39.6 112.72,38.4 | R2.2 114.6,36.5 112.72,38.38 112.72,38.4
XUSB
  Top 0.508: X2.1 32.05,105.48 28.83,102.27 F1.2

### Text on the board
tPlace: 13 | 12 | 11 | 10 | 9 | 8 | 7 | 6 | 5 | 4 | 3 | 2 | 1 | 0
tNames: AREF | GND | SCL | SDA | IOREF | RESET | GND | A0 | A1 | A2 | A3 | A4 | A5 | 5V | 3V3 | VIN | ANALOG IN
ReferenceLC: L | TX | ON | RX | PC1 | PC2
214bmp: D:/SmartProjects/Snc/a4_bn_logo2.bmp